# EAGLE schematic Solar Array Design (EAGLE 9.2.0)
[ - UCI Solar Car - FALL 2018 UCI Solar Car - FALL 2018 Solar Team Schematic
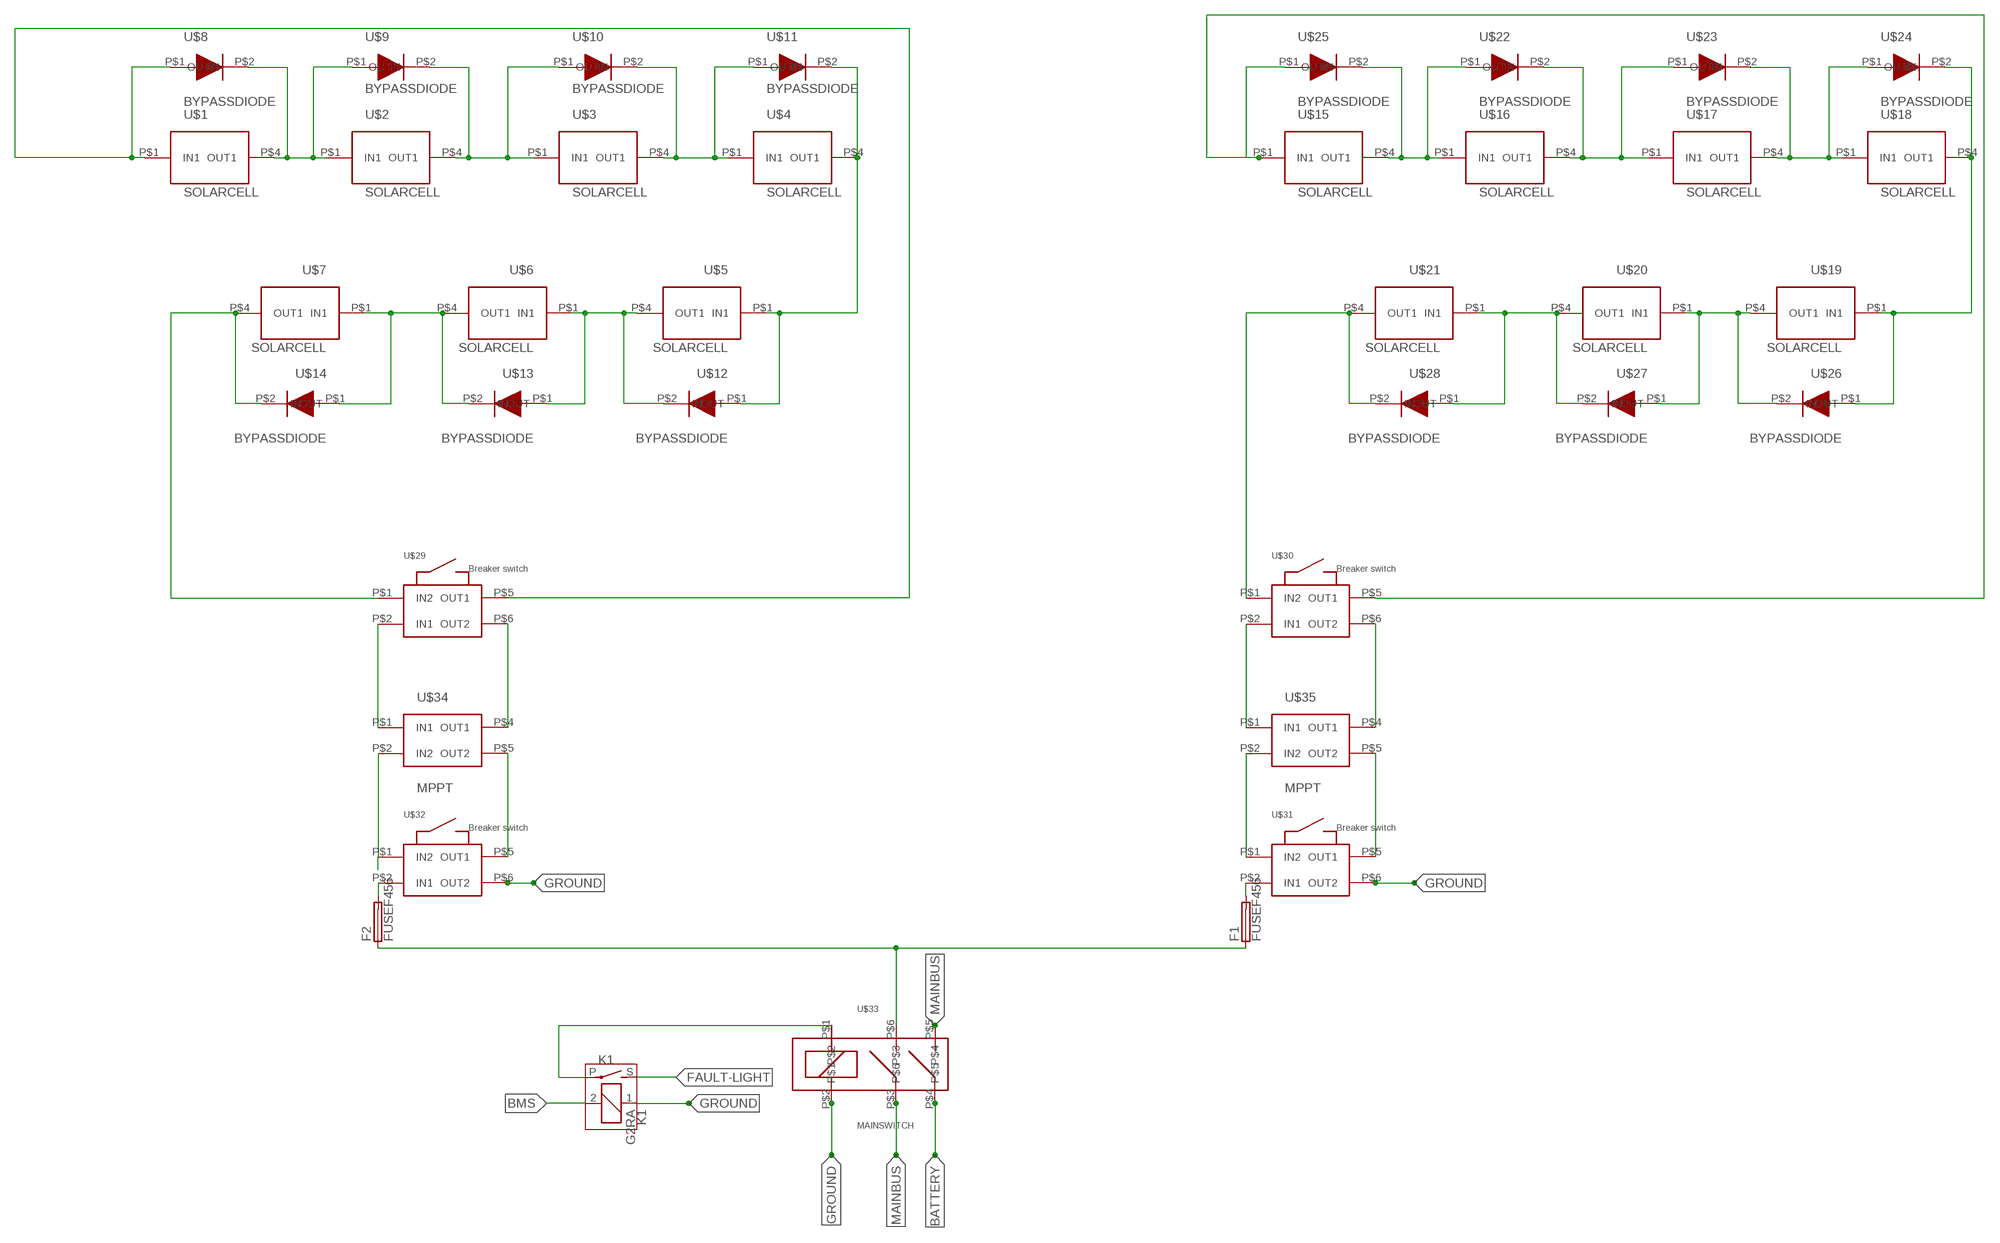
[diagram p0: schematic, sheet 1]

## Parts
F1  FUSEF456  [F456]
F2  FUSEF456  [F456]
K1  G2RA  [G2RA]
U$1  SOLARCELL  [SOLARCELL]
U$2  SOLARCELL  [SOLARCELL]
U$3  SOLARCELL  [SOLARCELL]
U$4  SOLARCELL  [SOLARCELL]
U$5  SOLARCELL  [SOLARCELL]
U$6  SOLARCELL  [SOLARCELL]
U$7  SOLARCELL  [SOLARCELL]
U$8  BYPASSDIODE  [BYPASSDIODE]
U$9  BYPASSDIODE  [BYPASSDIODE]
U$10  BYPASSDIODE  [BYPASSDIODE]
U$11  BYPASSDIODE  [BYPASSDIODE]
U$12  BYPASSDIODE  [BYPASSDIODE]
U$13  BYPASSDIODE  [BYPASSDIODE]
U$14  BYPASSDIODE  [BYPASSDIODE]
U$15  SOLARCELL  [SOLARCELL]
U$16  SOLARCELL  [SOLARCELL]
U$17  SOLARCELL  [SOLARCELL]
U$18  SOLARCELL  [SOLARCELL]
U$19  SOLARCELL  [SOLARCELL]
U$20  SOLARCELL  [SOLARCELL]
U$21  SOLARCELL  [SOLARCELL]
U$22  BYPASSDIODE  [BYPASSDIODE]
U$23  BYPASSDIODE  [BYPASSDIODE]
U$24  BYPASSDIODE  [BYPASSDIODE]
U$25  BYPASSDIODE  [BYPASSDIODE]
U$26  BYPASSDIODE  [BYPASSDIODE]
U$27  BYPASSDIODE  [BYPASSDIODE]
U$28  BYPASSDIODE  [BYPASSDIODE]
U$29  CIRCUITBREAKER  [CIRUITBREAKER]
U$30  CIRCUITBREAKER  [CIRUITBREAKER]
U$31  CIRCUITBREAKER  [CIRUITBREAKER]
U$32  CIRCUITBREAKER  [CIRUITBREAKER]
U$33  MAINSWITCH  [MAINSWITCH]
U$34  MPPT  [MPPT]
U$35  MPPT  [MPPT]

## Nets
BATTERY: U$33.P$4
BMS: K1.2
FAULT-LIGHT: K1.S(2:S)
GROUND: K1.1 U$31.P$6(OUT2) U$32.P$6(OUT2) U$33.P$2
MAINBUS: U$33.P$3 U$33.P$5
N$1: U$1.P$4(OUT1) U$2.P$1(IN1) U$8.P$2(OUT) U$9.P$1(IN)
N$2: U$2.P$4(OUT1) U$3.P$1(IN1) U$9.P$2(OUT) U$10.P$1(IN)
N$3: U$3.P$4(OUT1) U$4.P$1(IN1) U$10.P$2(OUT) U$11.P$1(IN)
N$4: U$4.P$4(OUT1) U$5.P$1(IN1) U$11.P$2(OUT) U$12.P$1(IN)
N$5: U$5.P$4(OUT1) U$6.P$1(IN1) U$12.P$2(OUT) U$13.P$1(IN)
N$6: U$6.P$4(OUT1) U$7.P$1(IN1) U$13.P$2(OUT) U$14.P$1(IN)
N$7: U$1.P$1(IN1) U$8.P$1(IN) U$29.P$5(OUT1)
N$8: U$7.P$4(OUT1) U$14.P$2(OUT) U$29.P$1(IN2)
N$9: U$15.P$4(OUT1) U$16.P$1(IN1) U$22.P$1(IN) U$25.P$2(OUT)
N$10: U$16.P$4(OUT1) U$17.P$1(IN1) U$22.P$2(OUT) U$23.P$1(IN)
N$11: U$17.P$4(OUT1) U$18.P$1(IN1) U$23.P$2(OUT) U$24.P$1(IN)
N$12: U$18.P$4(OUT1) U$19.P$1(IN1) U$24.P$2(OUT) U$26.P$1(IN)
N$13: U$19.P$4(OUT1) U$20.P$1(IN1) U$26.P$2(OUT) U$27.P$1(IN)
N$14: U$20.P$4(OUT1) U$21.P$1(IN1) U$27.P$2(OUT) U$28.P$1(IN)
N$15: U$30.P$6(OUT2) U$35.P$4(OUT1)
N$16: U$21.P$4(OUT1) U$28.P$2(OUT) U$30.P$1(IN2)
N$17: U$29.P$2(IN1) U$34.P$1(IN1)
N$18: U$29.P$6(OUT2) U$34.P$4(OUT1)
N$19: U$32.P$1(IN2) U$34.P$2(IN2)
N$20: U$15.P$1(IN1) U$25.P$1(IN) U$30.P$5(OUT1)
N$21: U$31.P$1(IN2) U$35.P$2(IN2)
N$22: U$31.P$5(OUT1) U$35.P$5(OUT2)
N$23: F1.2 U$31.P$2(IN1)
N$24: K1.P(2:P) U$33.P$1
N$26: U$30.P$2(IN1) U$35.P$1(IN1)
N$27: U$32.P$5(OUT1) U$34.P$5(OUT2)
N$28: F2.2 U$32.P$2(IN1)
N$29: F1.1 F2.1 U$33.P$6

## Library data of the parts
F1 F2 = fuse:FUSE: Fuse; OC_FARNELL: unknown; OC_NEWARK: unknown
K1 = relay:G2RA: RELAY 1 x norm. open, Omron; OC_FARNELL: unknown; OC_NEWARK: unknown
U$1-U$7 U$15-U$21 = Solar array design :SOLARCELL: solar team library - FALL 2018 Design FALL 2018 Solar Cells: Sunpower C60 Kpr Website: https://us.sunpower.com/sites/sunpower/files/media-library/spec-sheets/sp-sunpower-maxeon-solar-cells-gen2.pdf
U$8-U$14 U$22-U$28 = Solar array design :BYPASSDIODE: solar team library - FALL 2018 Design FALL 2018 Bypass Diode
U$29-U$32 = Solar array design :CIRCUITBREAKER
U$33 = Solar array design :MAINSWITCH
U$34 U$35 = SOLAR:MPPT: solar team library - FALL 2018 Design fall 2018 1) MPPT: MG Solar WSC-Si Website: https://www.mgenergysystems.eu